# EAGLE schematic line_follower (EAGLE 6.5.0)
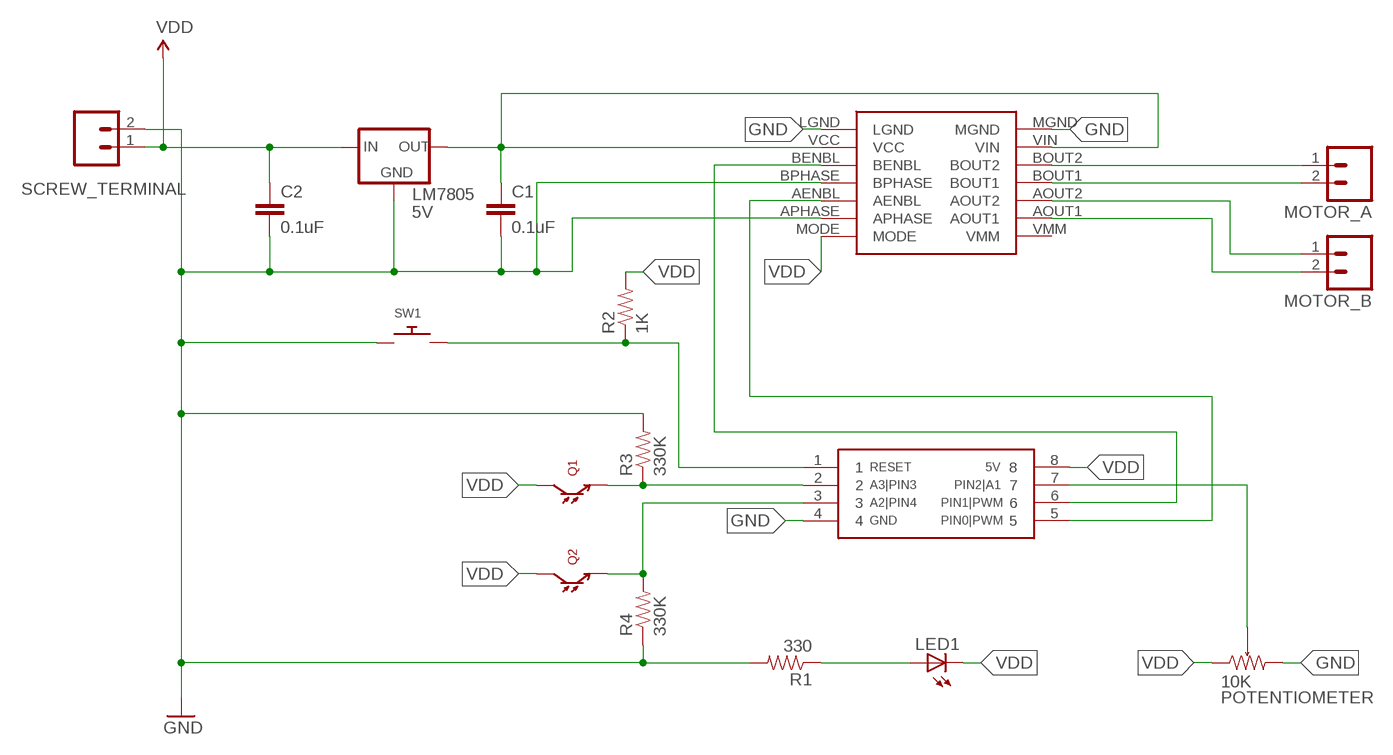
[diagram p0: schematic, sheet 1]

## Parts
10K  POTENTIOMETER  [0603-ARV]
ATTINY85  ATTINY85  [ATTINY_DIP]
C1  0.1uF  CAPEZ  [CAP-PTH-SMALLEZ]
C2  0.1uF  CAPEZ  [CAP-PTH-SMALLEZ]
DRV8835  POLOLU_MOTOR_DRV8835THROUGHHOLE  [POLOLU_MOTOR_DRV_DRV8835]
LED1  LED5MM  [LED5MM]
LM7805  5V  78XXS  [78XXS]
MOTOR_A  M02PTH  [1X02]
MOTOR_B  M02PTH  [1X02]
Q1  LTR-301  [LTR-301]
Q2  LTR-301  [LTR-301]
R1  330  RESISTOREZ  [AXIAL-0.3EZ]
R2  1K  RESISTOREZ  [AXIAL-0.3EZ]
R3  330K  RESISTOREZ  [AXIAL-0.3EZ]
R4  330K  RESISTOREZ  [AXIAL-0.3EZ]
SCREW_TERMINAL  M02JST-PTH-VERT  [JST-2-PTH-VERT]
SW1  SWITCH_PUSHBUTTONEVQ-PE  [TACT_PANA-EVQ]

## Nets
GND: 10K.2 ATTINY85.4 C1.2 C2.2 DRV8835.APHASE DRV8835.BPHASE DRV8835.LGND DRV8835.MGND LM7805.GND R1.P$2 R3.P$2 R4.P$1 SCREW_TERMINAL.2 SW1.P$1
N$1: 10K.3 10K.4 10K.5 10K.6 10K.7 10K.8 ATTINY85.7
N$2: ATTINY85.1 R2.P$1 SW1.P$2
N$3: ATTINY85.3 Q2.E R4.P$2
N$4: ATTINY85.5 DRV8835.AENBL
N$5: ATTINY85.6 DRV8835.BENBL
N$6: LED1.A R1.P$1
N$7: DRV8835.AOUT1 MOTOR_B.2
N$8: DRV8835.AOUT2 MOTOR_B.1
N$9: DRV8835.BOUT1 MOTOR_A.2
N$10: DRV8835.BOUT2 MOTOR_A.1
N$11: ATTINY85.2 Q1.E R3.P$1
VDD: 10K.1 ATTINY85.8 C1.1 C2.1 DRV8835.MODE DRV8835.VCC DRV8835.VIN LED1.K(C) LM7805.IN LM7805.OUT Q1.C Q2.C R2.P$2 SCREW_TERMINAL.1
Unconnected: DRV8835.VMM

## Library data of the parts
10K = SparkFun-Passives:POTENTIOMETER
ATTINY85 = nurc:ATTINY85
C1 C2 = SparkFun-Capacitors:CAP: Capacitor Standard 0603 ceramic capacitor, and 0.1" leaded capacitor.
DRV8835 = pololu:POLOLU_MOTOR_DRV8835
LED1 = adafruit:LED: LED OSRAM: - CHIPLED LG R971, LG N971, LY N971, LG Q971, LY Q971, LO R971, LY R971 LH N974, LH R974 LS Q976, LO Q976, LY Q976 LO Q996 - Hyper CHIPLED LW Q18S LB Q993, LB Q99A, LB R99A - SideLED LS A670, LO A670, LY A670, LG A670, LP A670 LB A673, LV A673, LT A673, LW A673 LH A674 LY A675 LS A676, LA A676, LO A676, LY A676, LW A676 LS A679, LY A679, LG A679 - Hyper Micro SIDELED® LS Y876, LA Y876, LO Y876, LY Y876 LT Y87S - SmartLED LW L88C, LW L88S LB L89C, LB L89S, LG L890 LS L89K, LO L89K, LY L89K LS L896, LA L896, LO L896, LY L896 - TOPLED LS T670, LO T670, LY T670, LG T670, LP T670 LSG T670, LSP T670, LSY T670, LOP T670, LYG T670 LG T671, LOG T671, LSG T671 LB T673, LV T673, LT T673, LW T673 LH T674 LS T676, LA T676, LO T676, LY T676, LB T676, LH T676, LSB T676, LW T676 LB T67C, LV T67C, LT T67C, LS T67K, LO T67K, LY T67K, LW E67C LS E67B, LA E67B, LO E67B, LY E67B, LB E67C, LV E67C, LT E67C LW T67C LS T679, LY T679, LG T679 LS T770, LO T770, LY T770, LG T770, LP T770 LB T773, LV T773, LT T773, LW T773 LH T774 LS E675, LA E675, LY E675, LS T675 LS T776, LA T776, LO T776, LY T776, LB T776 LHGB T686 LT T68C, LB T68C - Hyper Mini TOPLED® LB M676 - Mini TOPLED Santana® LG M470 LS M47K, LO M47K, LY M47K Source: http://www.osram.convergy.de/
LM7805 = v-reg:78XXS: VOLTAGE REGULATOR
MOTOR_A MOTOR_B SCREW_TERMINAL = SparkFun-Connectors:M02: Standard 2-pin 0.1" header. Use with - straight break away headers ( PRT-00116) - right angle break away headers (PRT-00553) - swiss pins (PRT-00743) - machine pins (PRT-00117) - female headers (PRT-00115) Molex polarized connector foot print use with: PRT-08233 with associated crimp pins and housings. 2.54_SCREWTERM for use with PRT-10571. 3.5mm Screw Terminal footprints for PRT-08084 5mm Screw Terminal footprints for use with PRT-08432
Q1 Q2 = SparkFun-Sensors:LTR-301: Through-hole side-receiving IR phototransistor
R1-R4 = SparkFun-Passives:RESISTOR: Resistor Basic schematic elements and footprints for 0603, 1206, and PTH resistors.
SW1 = adafruit:SWITCH_PUSHBUTTON: Buttons SOFTTOUCHSMD_SJ - Soft touch temporary push button (Super Junk Akihabara) Compatible with SKPMANE010 [Mouser: 688-SKPMAN] C&K_KSS = Digikey: KSS221GLFS